# Altium schematic sheet comicition.SchDoc
size A4
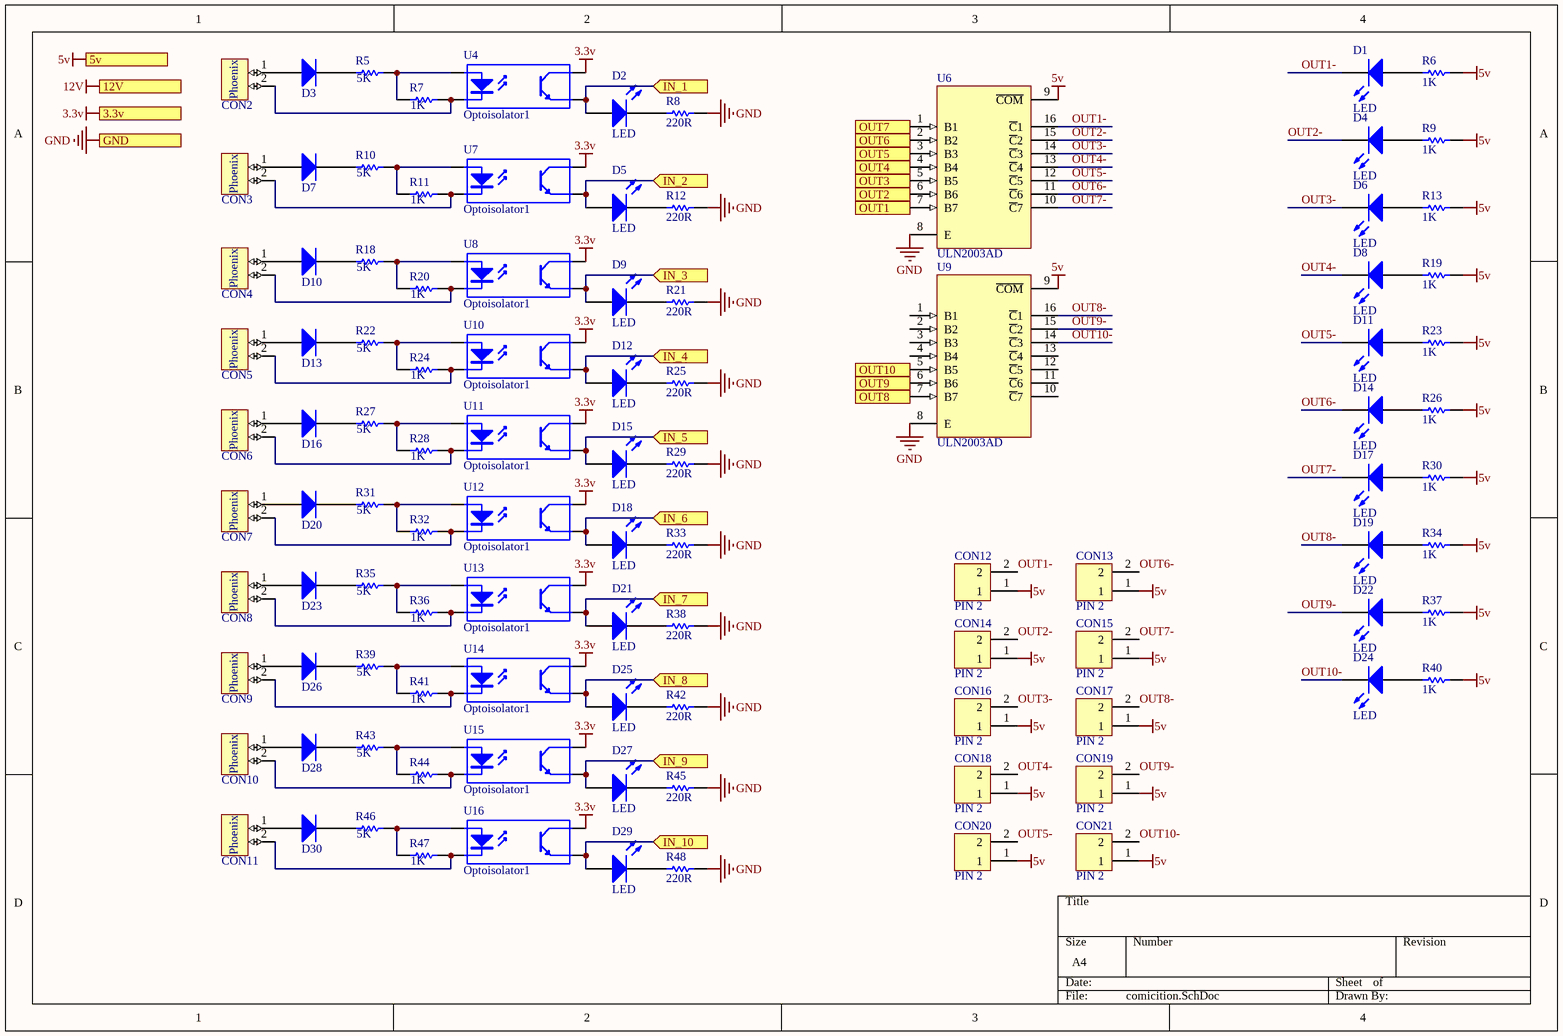
[diagram p0: comicition.SchDoc]

## Parts
CON2  PHOENIX 2  [phonix 2]  (value not drawn)
CON3  PHOENIX 2  [phonix 2]  (value not drawn)
CON4  PHOENIX 2  [phonix 2]  (value not drawn)
CON5  PHOENIX 2  [phonix 2]  (value not drawn)
CON6  PHOENIX 2  [phonix 2]  (value not drawn)
CON7  PHOENIX 2  [phonix 2]  (value not drawn)
CON8  PHOENIX 2  [phonix 2]  (value not drawn)
CON9  PHOENIX 2  [phonix 2]  (value not drawn)
CON10  PHOENIX 2  [phonix 2]  (value not drawn)
CON11  PHOENIX 2  [phonix 2]  (value not drawn)
CON12  PIN 2  [PIN 2]
CON13  PIN 2  [PIN 2]
CON14  PIN 2  [PIN 2]
CON15  PIN 2  [PIN 2]
CON16  PIN 2  [PIN 2]
CON17  PIN 2  [PIN 2]
CON18  PIN 2  [PIN 2]
CON19  PIN 2  [PIN 2]
CON20  PIN 2  [PIN 2]
CON21  PIN 2  [PIN 2]
D1  LED  [led 5mm]
D2  LED  [led 5mm]
D3  1N4007  [RES 1206 (3216X08L)]  (value not drawn)
D4  LED  [led 5mm]
D5  LED  [led 5mm]
D6  LED  [led 5mm]
D7  1N4007  [RES 1206 (3216X08L)]  (value not drawn)
D8  LED  [led 5mm]
D9  LED  [led 5mm]
D10  1N4007  [RES 1206 (3216X08L)]  (value not drawn)
D11  LED  [led 5mm]
D12  LED  [led 5mm]
D13  1N4007  [RES 1206 (3216X08L)]  (value not drawn)
D14  LED  [led 5mm]
D15  LED  [led 5mm]
D16  1N4007  [RES 1206 (3216X08L)]  (value not drawn)
D17  LED  [led 5mm]
D18  LED  [led 5mm]
D19  LED  [led 5mm]
D20  1N4007  [RES 1206 (3216X08L)]  (value not drawn)
D21  LED  [led 5mm]
D22  LED  [led 5mm]
D23  1N4007  [RES 1206 (3216X08L)]  (value not drawn)
D24  LED  [led 5mm]
D25  LED  [led 5mm]
D26  1N4007  [RES 1206 (3216X08L)]  (value not drawn)
D27  LED  [led 5mm]
D28  1N4007  [RES 1206 (3216X08L)]  (value not drawn)
D29  LED  [led 5mm]
D30  1N4007  [RES 1206 (3216X08L)]  (value not drawn)
R5  value 5K  [RES 0805 (2012X06L)]  (hidden comment: resistor)
R6  value 1K  [RES 0805 (2012X06L)]  (hidden comment: resistor)
R7  value 1K  [RES 0805 (2012X06L)]  (hidden comment: resistor)
R8  value 220R  [RES 0805 optional]  (hidden comment: resistor)
R9  value 1K  [RES 0805 (2012X06L)]  (hidden comment: resistor)
R10  value 5K  [RES 0805 (2012X06L)]  (hidden comment: resistor)
R11  value 1K  [RES 0805 (2012X06L)]  (hidden comment: resistor)
R12  value 220R  [RES 0805 optional]  (hidden comment: resistor)
R13  value 1K  [RES 0805 (2012X06L)]  (hidden comment: resistor)
R18  value 5K  [RES 0805 (2012X06L)]  (hidden comment: resistor)
R19  value 1K  [RES 0805 (2012X06L)]  (hidden comment: resistor)
R20  value 1K  [RES 0805 (2012X06L)]  (hidden comment: resistor)
R21  value 220R  [RES 0805 optional]  (hidden comment: resistor)
R22  value 5K  [RES 0805 (2012X06L)]  (hidden comment: resistor)
R23  value 1K  [RES 0805 (2012X06L)]  (hidden comment: resistor)
R24  value 1K  [RES 0805 (2012X06L)]  (hidden comment: resistor)
R25  value 220R  [RES 0805 optional]  (hidden comment: resistor)
R26  value 1K  [RES 0805 (2012X06L)]  (hidden comment: resistor)
R27  value 5K  [RES 0805 (2012X06L)]  (hidden comment: resistor)
R28  value 1K  [RES 0805 (2012X06L)]  (hidden comment: resistor)
R29  value 220R  [RES 0805 optional]  (hidden comment: resistor)
R30  value 1K  [RES 0805 (2012X06L)]  (hidden comment: resistor)
R31  value 5K  [RES 0805 (2012X06L)]  (hidden comment: resistor)
R32  value 1K  [RES 0805 (2012X06L)]  (hidden comment: resistor)
R33  value 220R  [RES 0805 optional]  (hidden comment: resistor)
R34  value 1K  [RES 0805 (2012X06L)]  (hidden comment: resistor)
R35  value 5K  [RES 0805 (2012X06L)]  (hidden comment: resistor)
R36  value 1K  [RES 0805 (2012X06L)]  (hidden comment: resistor)
R37  value 1K  [RES 0805 (2012X06L)]  (hidden comment: resistor)
R38  value 220R  [RES 0805 optional]  (hidden comment: resistor)
R39  value 5K  [RES 0805 (2012X06L)]  (hidden comment: resistor)
R40  value 1K  [RES 0805 (2012X06L)]  (hidden comment: resistor)
R41  value 1K  [RES 0805 (2012X06L)]  (hidden comment: resistor)
R42  value 220R  [RES 0805 optional]  (hidden comment: resistor)
R43  value 5K  [RES 0805 (2012X06L)]  (hidden comment: resistor)
R44  value 1K  [RES 0805 (2012X06L)]  (hidden comment: resistor)
R45  value 220R  [RES 0805 optional]  (hidden comment: resistor)
R46  value 5K  [RES 0805 (2012X06L)]  (hidden comment: resistor)
R47  value 1K  [RES 0805 (2012X06L)]  (hidden comment: resistor)
R48  value 220R  [RES 0805 optional]  (hidden comment: resistor)
U4  Optoisolator1  [DIP-4]
U6  ULN2003AD  [D016_N]
U7  Optoisolator1  [DIP-4]
U8  Optoisolator1  [DIP-4]
U9  ULN2003AD  [D016_N]
U10  Optoisolator1  [DIP-4]
U11  Optoisolator1  [DIP-4]
U12  Optoisolator1  [DIP-4]
U13  Optoisolator1  [DIP-4]
U14  Optoisolator1  [DIP-4]
U15  Optoisolator1  [DIP-4]
U16  Optoisolator1  [DIP-4]

## Ports
3.3v, 5v, 12V, GND, IN_1 (in), IN_2 (in), IN_3 (in), IN_4 (in), IN_5 (in), IN_6 (in), IN_7 (in), IN_8 (in), IN_9 (in), IN_10 (in), OUT1 (out), OUT2 (out), OUT3 (out), OUT4 (out), OUT5 (out), OUT6 (out), OUT7 (out), OUT8 (out), OUT9 (out), OUT10 (out)

## Nets
3.3v: U4.4(C) U7.4(C) U8.4(C) U10.4(C) U11.4(C) U12.4(C) U13.4(C) U14.4(C) U15.4(C) U16.4(C) ; port 3.3v
5v: CON12.1 CON13.1 CON14.1 CON15.1 CON16.1 CON17.1 CON18.1 CON19.1 CON20.1 CON21.1 R6.2 R9.2 R13.2 R19.2 R23.2 R26.2 R30.2 R34.2 R37.2 R40.2 U6.9(~{COM}) U9.9(~{COM}) ; port 5v
12V: port 12V
GND: R8.1 R12.1 R21.1 R25.1 R29.1 R33.1 R38.1 R42.1 R45.1 R48.1 U6.8(E) U9.8(E) ; port GND
IN_1: D2.1(A) U4.3(E) ; port IN_1
IN_2: D5.1(A) U7.3(E) ; port IN_2
IN_3: D9.1(A) U8.3(E) ; port IN_3
IN_4: D12.1(A) U10.3(E) ; port IN_4
IN_5: D15.1(A) U11.3(E) ; port IN_5
IN_6: D18.1(A) U12.3(E) ; port IN_6
IN_7: D21.1(A) U13.3(E) ; port IN_7
IN_8: D25.1(A) U14.3(E) ; port IN_8
IN_9: D27.1(A) U15.3(E) ; port IN_9
IN_10: D29.1(A) U16.3(E) ; port IN_10
OUT1: U6.7(B7) ; port OUT1
OUT1-: CON12.2 D1.2(K) U6.16(~{C}1)
OUT2: U6.6(B6) ; port OUT2
OUT2-: CON14.2 D4.2(K) U6.15(~{C}2)
OUT3: U6.5(B5) ; port OUT3
OUT3-: CON16.2 D6.2(K) U6.14(~{C}3)
OUT4: U6.4(B4) ; port OUT4
OUT4-: CON18.2 D8.2(K) U6.13(~{C}4)
OUT5: U6.3(B3) ; port OUT5
OUT5-: CON20.2 D11.2(K) U6.12(~{C}5)
OUT6: U6.2(B2) ; port OUT6
OUT6-: CON13.2 D14.2(K) U6.11(~{C}6)
OUT7: U6.1(B1) ; port OUT7
OUT7-: CON15.2 D17.2(K) U6.10(~{C}7)
OUT8: U9.7(B7) ; port OUT8
OUT8-: CON17.2 D19.2(K) U9.16(~{C}1)
OUT9: U9.6(B6) ; port OUT9
OUT9-: CON19.2 D22.2(K) U9.15(~{C}2)
OUT10: U9.5(B5) ; port OUT10
OUT10-: CON21.2 D24.2(K) U9.14(~{C}3)
NetCON2_1: CON2.1 D3.1(A)
NetCON2_2: CON2.2 R7.2 U4.2(K)
NetCON3_1: CON3.1 D7.1(A)
NetCON3_2: CON3.2 R11.2 U7.2(K)
NetCON4_1: CON4.1 D10.1(A)
NetCON4_2: CON4.2 R20.2 U8.2(K)
NetCON5_1: CON5.1 D13.1(A)
NetCON5_2: CON5.2 R24.2 U10.2(K)
NetCON6_1: CON6.1 D16.1(A)
NetCON6_2: CON6.2 R28.2 U11.2(K)
NetCON7_1: CON7.1 D20.1(A)
NetCON7_2: CON7.2 R32.2 U12.2(K)
NetCON8_1: CON8.1 D23.1(A)
NetCON8_2: CON8.2 R36.2 U13.2(K)
NetCON9_1: CON9.1 D26.1(A)
NetCON9_2: CON9.2 R41.2 U14.2(K)
NetCON10_1: CON10.1 D28.1(A)
NetCON10_2: CON10.2 R44.2 U15.2(K)
NetCON11_1: CON11.1 D30.1(A)
NetCON11_2: CON11.2 R47.2 U16.2(K)
NetD1_1: D1.1(A) R6.1
NetD2_2: D2.2(K) R8.2
NetD3_2: D3.2(K) R5.1
NetD4_1: D4.1(A) R9.1
NetD5_2: D5.2(K) R12.2
NetD6_1: D6.1(A) R13.1
NetD7_2: D7.2(K) R10.1
NetD8_1: D8.1(A) R19.1
NetD9_2: D9.2(K) R21.2
NetD10_2: D10.2(K) R18.1
NetD11_1: D11.1(A) R23.1
NetD12_2: D12.2(K) R25.2
NetD13_2: D13.2(K) R22.1
NetD14_1: D14.1(A) R26.1
NetD15_2: D15.2(K) R29.2
NetD16_2: D16.2(K) R27.1
NetD17_1: D17.1(A) R30.1
NetD18_2: D18.2(K) R33.2
NetD19_1: D19.1(A) R34.1
NetD20_2: D20.2(K) R31.1
NetD21_2: D21.2(K) R38.2
NetD22_1: D22.1(A) R37.1
NetD23_2: D23.2(K) R35.1
NetD24_1: D24.1(A) R40.1
NetD25_2: D25.2(K) R42.2
NetD26_2: D26.2(K) R39.1
NetD27_2: D27.2(K) R45.2
NetD28_2: D28.2(K) R43.1
NetD29_2: D29.2(K) R48.2
NetD30_2: D30.2(K) R46.1
NetR5_2: R5.2 R7.1 U4.1(A)
NetR10_2: R10.2 R11.1 U7.1(A)
NetR18_2: R18.2 R20.1 U8.1(A)
NetR22_2: R22.2 R24.1 U10.1(A)
NetR27_2: R27.2 R28.1 U11.1(A)
NetR31_2: R31.2 R32.1 U12.1(A)
NetR35_2: R35.2 R36.1 U13.1(A)
NetR39_2: R39.2 R41.1 U14.1(A)
NetR43_2: R43.2 R44.1 U15.1(A)
NetR46_2: R46.2 R47.1 U16.1(A)

Not connected (* = marked no-connect by the designer): U9 1(B1) 2(B2) 3(B3) 4(B4) 10(~{C}7) 11(~{C}6) 12(~{C}5) 13(~{C}4)

## Notes on the sheet
- (in symbol PHOENIX 2) Phoenix

## Library data of the parts
U4 U7 U8 U10-U16 = Optoisolator1: 4-Pin Phototransistor Optocoupler; Published: 24-Mar-1999; LatestRevisionDate: 04-Mar-2005; LatestRevisionNote: Sch pins 3 & 4 Swapped.; DatasheetVersion: Nov-2003; PackageReference: DIP-4; Publisher: Altium Limited
U6 U9 = ULN2003AD: Darlington Transistor Array; Published: 15-May-2002; LatestRevisionDate: 13-Apr-2006; LatestRevisionNote: IPC-7351 Footprint Added.; DatasheetVersion: Sep-1986; PackageVersion: Jan-1998; PackageReference: D016; Publisher: Altium Limited; PackageDescription: 16-Pin Small Outline Integrated Circuit 1.27 mm Pitch; Code_IPC: SOIC127P600-16; ComponentLink1Description: Manufacturer Link; ComponentLink1URL: http://www.ti.com/; ComponentLink2Description: Datasheet; ComponentLink2URL: http://www-s.ti.com/sc/ds/uln2002a.pdf